# Altium schematic sheet Reader32chv2.SchDoc
size A4
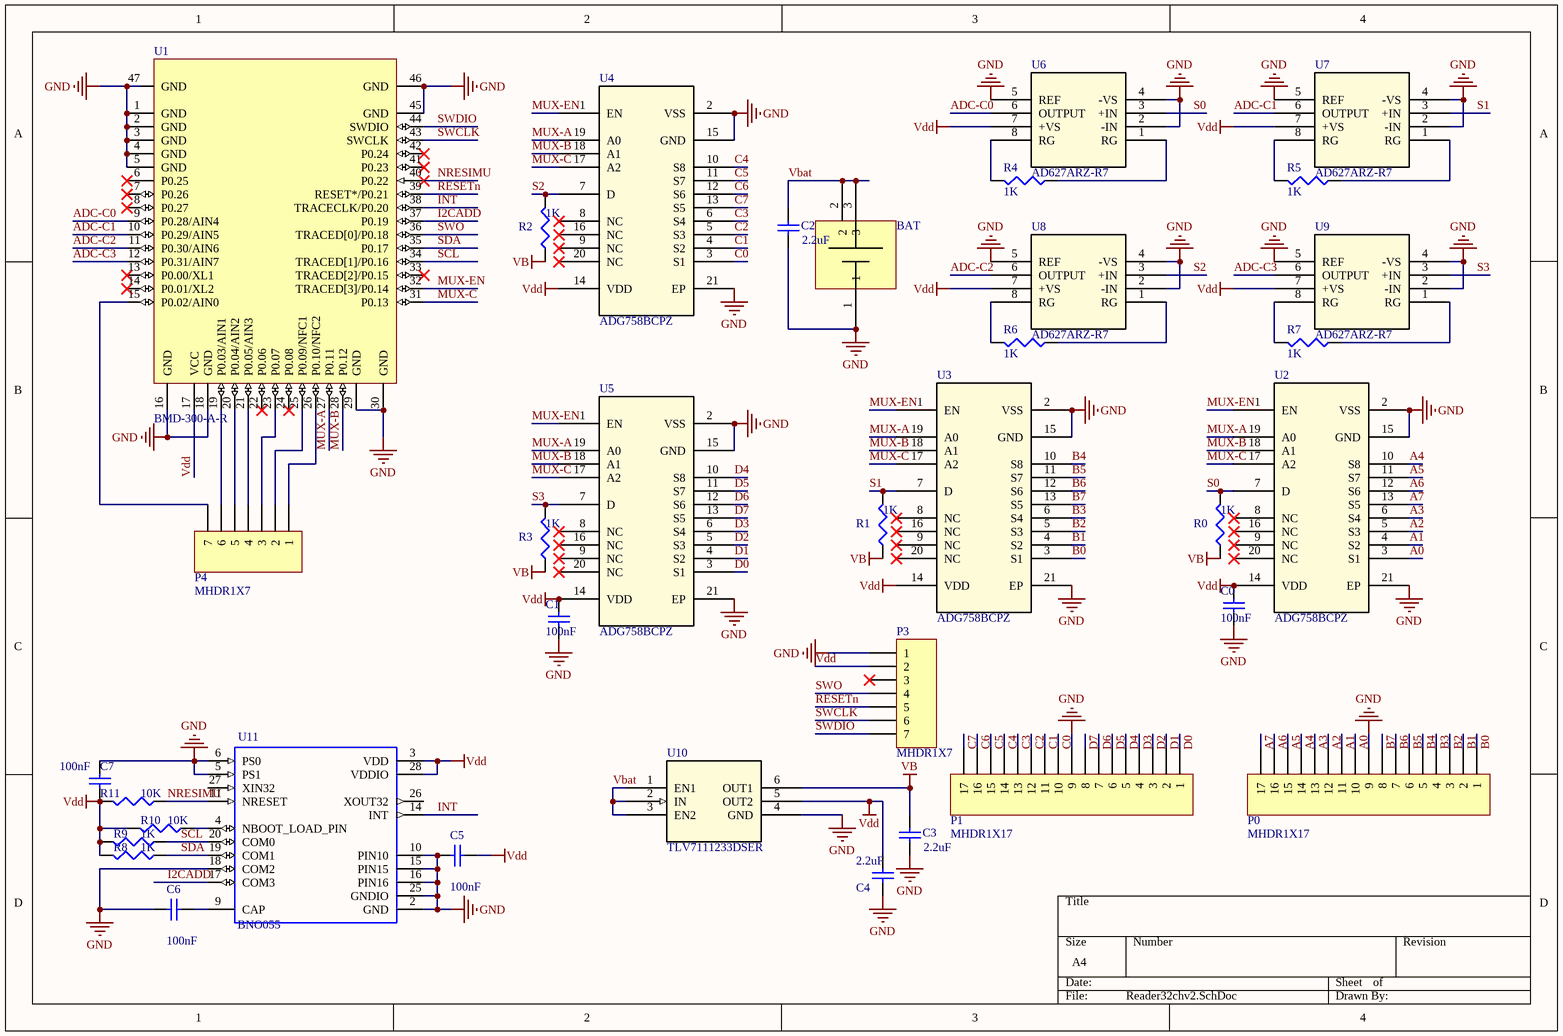
[diagram p0: Reader32chv2.SchDoc]

## Parts
BAT  (no value)  [BU-2032]
C0  value 100nF  [1608[0603]]
C1  value 100nF  [1608[0603]]
C2  value 2.2uF  [1608[0603]]
C3  value 2.2uF  [1608[0603]]
C4  value 2.2uF  [1608[0603]]
C5  value 100nF  [1608[0603]]
C6  value 100nF  [1608[0603]]
C7  value 100nF  [1608[0603]]
P0  MHDR1X17  [MHDR1X17]
P1  MHDR1X17  [MHDR1X17]
P3  MHDR1X7  [MHDR1X7]
P4  MHDR1X7  [MHDR1X7]
R0  value 1K  [J1-0603]
R1  value 1K  [J1-0603]
R2  value 1K  [J1-0603]
R3  value 1K  [J1-0603]
R4  value 1K  [J1-0603]
R5  value 1K  [J1-0603]
R6  value 1K  [J1-0603]
R7  value 1K  [J1-0603]
R8  value 1K  [J1-0603]
R9  value 1K  [J1-0603]
R10  value 10K  [J1-0603]
R11  value 10K  [J1-0603]
U1  Manufacturer P/N: BMD-300-A-R  [BMD-300]  (hidden comment: BMD-300)
U2  ADG758BCPZ  [CP_20_6]
U3  ADG758BCPZ  [CP_20_6]
U4  ADG758BCPZ  [CP_20_6]
U5  ADG758BCPZ  [CP_20_6]
U6  AD627ARZ-R7  [R_8]
U7  AD627ARZ-R7  [R_8]
U8  AD627ARZ-R7  [R_8]
U9  AD627ARZ-R7  [R_8]
U10  TLV7111233DSER  [DSE6]
U11  BNO055  [LGA28R50P4X10_380X520X100]

## Nets
GND: BAT.1 C0.2 C1.2 C2.1 C3.1 C4.1 C5.1 C6.1 C7.1 P0.9 P1.9 P3.1 U1.1(GND) U1.2(GND) U1.3(GND) U1.4(GND) U1.5(GND) U1.16(GND) U1.18(GND) U1.29(GND) U1.30(GND) U1.45(GND) U1.46(GND) U1.47(GND) U2.2(VSS) U2.15(GND) U2.21(EP) U3.2(VSS) U3.15(GND) U3.21(EP) U4.2(VSS) U4.15(GND) U4.21(EP) U5.2(VSS) U5.15(GND) U5.21(EP) U6.2(-IN) U6.4(-VS) U6.5(REF) U7.2(-IN) U7.4(-VS) U7.5(REF) U8.2(-IN) U8.4(-VS) U8.5(REF) U9.2(-IN) U9.4(-VS) U9.5(REF) U10.4(GND) U11.2(GND) U11.5(PS1) U11.6(PS0) U11.10(PIN10) U11.15(PIN15) U11.16(PIN16) U11.18(COM2) U11.25(GNDIO)
VB: C3.2 R0.1 R1.1 R2.1 R3.1 U10.6(OUT1)
Vdd: C0.1 C1.1 C4.2 C5.2 C7.2 P3.2 R8.2 R9.2 R10.2 R11.2 U1.17(VCC) U2.14(VDD) U3.14(VDD) U4.14(VDD) U5.14(VDD) U6.7(+VS) U7.7(+VS) U8.7(+VS) U9.7(+VS) U10.5(OUT2) U11.3(VDD) U11.28(VDDIO)
A0: P0.10 U2.3(S1)
A1: P0.11 U2.4(S2)
A2: P0.12 U2.5(S3)
A3: P0.13 U2.6(S4)
A4: P0.14 U2.10(S8)
A5: P0.15 U2.11(S7)
A6: P0.16 U2.12(S6)
A7: P0.17 U2.13(S5)
ADC-C0: U1.9(P0.28/AIN4) U6.6(OUTPUT)
ADC-C1: U1.10(P0.29/AIN5) U7.6(OUTPUT)
ADC-C2: U1.11(P0.30/AIN6) U8.6(OUTPUT)
ADC-C3: U1.12(P0.31/AIN7) U9.6(OUTPUT)
B0: P0.1 U3.3(S1)
B1: P0.2 U3.4(S2)
B2: P0.3 U3.5(S3)
B3: P0.4 U3.6(S4)
B4: P0.5 U3.10(S8)
B5: P0.6 U3.11(S7)
B6: P0.7 U3.12(S6)
B7: P0.8 U3.13(S5)
C0: P1.10 U4.3(S1)
C1: P1.11 U4.4(S2)
C2: P1.12 U4.5(S3)
C3: P1.13 U4.6(S4)
C4: P1.14 U4.10(S8)
C5: P1.15 U4.11(S7)
C6: P1.16 U4.12(S6)
C7: P1.17 U4.13(S5)
D0: P1.1 U5.3(S1)
D1: P1.2 U5.4(S2)
D2: P1.3 U5.5(S3)
D3: P1.4 U5.6(S4)
D4: P1.5 U5.10(S8)
D5: P1.6 U5.11(S7)
D6: P1.7 U5.12(S6)
D7: P1.8 U5.13(S5)
I2CADD: U1.37(P0.19) U11.17(COM3)
INT: U1.38(TRACECLK/P0.20) U11.14(INT)
MUX-A: U1.27(P0.11) U2.19(A0) U3.19(A0) U4.19(A0) U5.19(A0)
MUX-B: U1.28(P0.12) U2.18(A1) U3.18(A1) U4.18(A1) U5.18(A1)
MUX-C: U1.31(P0.13) U2.17(A2) U3.17(A2) U4.17(A2) U5.17(A2)
MUX-EN: U1.32(TRACED[3]/P0.14) U2.1(EN) U3.1(EN) U4.1(EN) U5.1(EN)
NRESIMU: R11.1 U1.40(P0.22) U11.11(NRESET)
RESETn: P3.5 U1.39(RESET*/P0.21)
S0: R0.2 U2.7(D) U6.3(+IN)
S1: R1.2 U3.7(D) U7.3(+IN)
S2: R2.2 U4.7(D) U8.3(+IN)
S3: R3.2 U5.7(D) U9.3(+IN)
SCL: R9.1 U1.34(TRACED[1]/P0.16) U11.20(COM0)
SDA: R8.1 U1.35(P0.17) U11.19(COM1)
SWCLK: P3.6 U1.43(SWCLK)
SWDIO: P3.7 U1.44(SWDIO)
SWO: P3.4 U1.36(TRACED[0]/P0.18)
Vbat: BAT.2 BAT.3 C2.2 U10.1(EN1) U10.2(IN) U10.3(EN2)
NetC6_2: C6.2 U11.9(CAP)
NetP4_1: P4.1 U1.26(P0.10/NFC2)
NetP4_2: P4.2 U1.25(P0.09/NFC1)
NetP4_3: P4.3 U1.23(P0.07)
NetP4_4: P4.4 U1.21(P0.05/AIN3)
NetP4_5: P4.5 U1.20(P0.04/AIN2)
NetP4_6: P4.6 U1.19(P0.03/AIN1)
NetP4_7: P4.7 U1.15(P0.02/AIN0)
NetR4_1: R4.1 U6.1(RG)
NetR4_2: R4.2 U6.8(RG)
NetR5_1: R5.1 U7.1(RG)
NetR5_2: R5.2 U7.8(RG)
NetR6_1: R6.1 U8.1(RG)
NetR6_2: R6.2 U8.8(RG)
NetR7_1: R7.1 U9.1(RG)
NetR7_2: R7.2 U9.8(RG)
NetR10_1: R10.1 U11.4(NBOOT_LOAD_PIN)

Not connected (* = marked no-connect by the designer): P3 3*; U1 6(P0.25)* 7(P0.26)* 8(P0.27)* 13(P0.00/XL1)* 14(P0.01/XL2)* 22(P0.06)* 24(P0.08)* 33(TRACED[2]/P0.15)* 41(P0.23)* 42(P0.24)*; U2 8(NC)* 9(NC)* 16(NC)* 20(NC)*; U3 8(NC)* 9(NC)* 16(NC)* 20(NC)*; U4 8(NC)* 9(NC)* 16(NC)* 20(NC)*; U5 8(NC)* 9(NC)* 16(NC)* 20(NC)*; U11 26(XOUT32) 27(XIN32)

## Library data of the parts
BAT = BT
C0-C7 = Cap Semi: Capacitor (Semiconductor SIM Model); Published: 8-Jun-2000; LatestRevisionDate: 29-May-2009; LatestRevisionNote: IPC-7351 Footprint Added.; PackageReference: C1206; Publisher: Altium Limited; PackageDescription: Chip Capacitor
P0 P1 = MHDR1X17: Header, 17-Pin; LatestRevisionDate: 17-Jul-2002; LatestRevisionNote: Re-released for DXP Platform.; Publisher: Altium Limited
P3 P4 = MHDR1X7: Header, 7-Pin; LatestRevisionDate: 17-Jul-2002; LatestRevisionNote: Re-released for DXP Platform.; Publisher: Altium Limited
R0-R11 = Res3: Resistor; Published: 8-Jun-2000; LatestRevisionDate: 29-May-2009; LatestRevisionNote: IPC-7351 Footprint Added.; PackageReference: J1-0603; Publisher: Altium Limited; PackageDescription: Chip Resistor
U1 = BMD-300-A: Bluetooth 4.2 LE Module, nRF52832, 512kB Flash, 64kB RAM; Manufacturer: Rigado; Internal Antenna: Yes; Protocol: BLE 4.2; RF Freq: 2.4GHz; Added By: Cam N; Part Number: BMD-300-A; Size: 14mm x 9.8mm; Height: 1.9mm; Added Date: 10/14/2015
U2-U5 = ADG758BCPZ: Imported; Value: Value; Type: Type; RefDes: RefDes
U6-U9 = AD627ARZ-R7: Imported; Vendor: Analog Devices Inc; Built_By: EMA_UL_Team; C: Copyright (C) 2015 Accelerated Designs. All rights reserved; Manufacturer_Part_Number: AD627ARZ-R7; Value: Value; Type: Type; RefDes: RefDes
U10 = TLV7111233DSER: Imported; Vendor: Texas Instruments; Built_By: EMA_UL_Team; C: Copyright (C) 2015 Accelerated Designs. All rights reserved; Manufacturer_Part_Number: TLV7111233DSER; Manufacturer: Texas Instruments; Value: Value; Type: Type; RefDes: RefDes
U11 = BNO055: BNO055 9-axis Absolute Orientation Sensor _ SiP _ w/Sensors and Sensor Fusion; MF: Bosch; SnapEDA_Link: https://www.snapeda.com/parts/BNO055/Bosch%20Sensortec/view-part/?ref=snap; MP: BNO055; Package: LGA-28 Bosch; Price: 7.34 USD; Availability: Good; Value: *